# Altium schematic sheet clock_DS.SchDoc
size 209 x 297 mm; Address1: Address1; Address2: Address2; Address3: Address3; Address4: Address4; SheetNumber: 1; Scale: 1:1; Разраб.: Иванов; Обозначение документа: АБВГ.123456.001 Э3; Пров.: Петров; Утв.: Сидоров; Наименование организации: ОАО "Концерн "МПО-Гидроприбор"; Перв. применение: АБВГ.123456.000; Наименование изделия 1: Плата; Наименование изделия 2: Схема электрическая; Наименование изделия 3: принципиальная; Нач. отд.: Нач. отд.; Фамилия нач. отд.: Сидоров
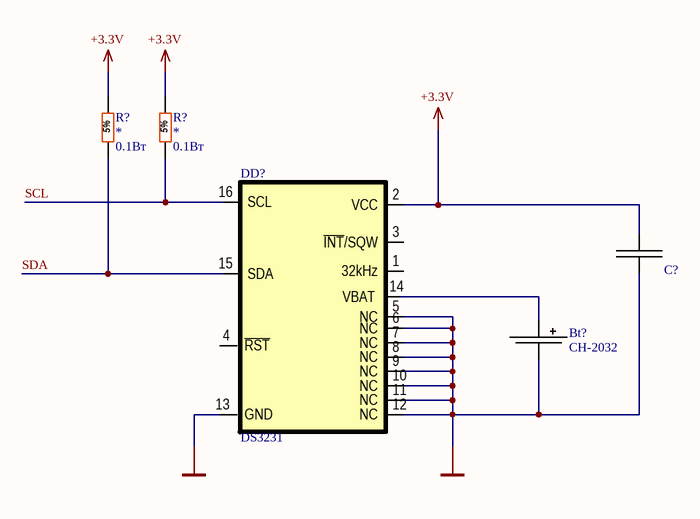
[diagram p0: clock_DS.SchDoc]

## Parts
(Parts that share a designator on the sheet are numbered #1, #2 ... from top to bottom, then left to right.)
Bt?  CH-2032  [CH25-2032]
C?  *  [CH0603L]  (value not drawn)
DD?  DS3231  [16-SOIC (W)]
R?#1  Power: 0.1Вт  [Res0603]  (hidden comment: *)
R?#2  Power: 0.1Вт  [Res0603]  (hidden comment: *)

## Nets
+3.3V: C?.1 DD?.2(VCC) R?#1.2 R?#2.2
GND: Bt?.2 C?.2 DD?.5(NC) DD?.6(NC) DD?.7(NC) DD?.8(NC) DD?.9(NC) DD?.10(NC) DD?.11(NC) DD?.12(NC) DD?.13(GND)
SCL: DD?.16(SCL) R?#2.1
SDA: DD?.15(SDA) R?#1.1
NetBt?_1: Bt?.1 DD?.14(VBAT)

Not connected (* = marked no-connect by the designer): DD? 1(32kHz) 3(~{INT}/SQW) 4(~{RST})

## Notes on the sheet
- Перв. примен.
- Справ. №
- Подп. и дата
- Инв. № дубл.
- Взам. инв. №
- Разраб.
- Изм.
- Лист
- № докум.
- Подп.
- Дата
- Лит.
- Масса
- Масштаб
- Пров.
- Т.контр.
- Листов
- Инв. № подл.
- Утв.
- Н.контр.
- 2.106-A4
- Копировал
- Формат А4

## Library data of the parts
Bt? = CR-2032: Value: *; Quantity: *; Part Number: *; Manufacturer: *; Package: *; Price: *; ShoppingPlace: *; Documentation: *; Type: Bt
C? = Capasitor: Value: *; Voltage: *; Part Number: *; Quantity: *; Package: *; Price: *; Manufacturer: *; ShoppingPlace: *
DD? = DS3231: Manufacturer: MAXIM; Part Number: DS3231; Package: SO-16; Quantity: 1; Tolerance: *; Type: IC; Voltage: *; Power: *
R?#1 R?#2 = Res0603_5%: Voltage: 50В; Tolerance: 5%; Manufacturer: *; Quntity: *; Price: *; Part Number: *; Package: 0603; Doc: *; Value: *